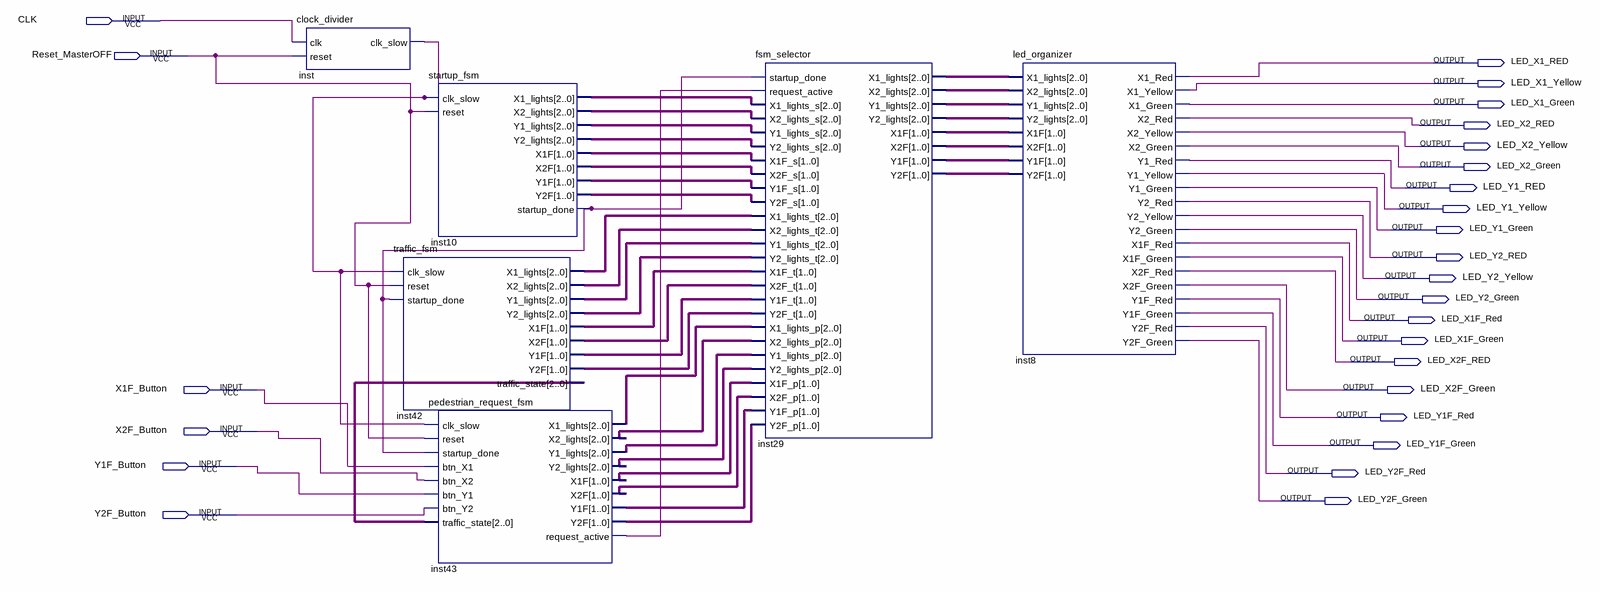
[diagram p0: schematic sheet]
// Quartus schematic Trafic_light.bdf as structural Verilog: 6 symbols, 26 pins
module Trafic_light (
  input  CLK,
  input  Reset_MasterOFF,
  input  X1F_Button,
  input  X2F_Button,
  input  Y1F_Button,
  input  Y2F_Button,
  output LED_X1_RED,
  output LED_X1_Yellow,
  output LED_X1_Green,
  output LED_X2_RED,
  output LED_X2_Yellow,
  output LED_X2_Green,
  output LED_Y1_RED,
  output LED_Y1_Yellow,
  output LED_Y1_Green,
  output LED_Y2_RED,
  output LED_Y2_Yellow,
  output LED_Y2_Green,
  output LED_X1F_Red,
  output LED_X1F_Green,
  output LED_X2F_RED,
  output LED_X2F_Green,
  output LED_Y1F_Red,
  output LED_Y1F_Green,
  output LED_Y2F_Red,
  output LED_Y2F_Green
);

  wire inst10_startup_done, inst43_request_active, inst_clk_slow;
  wire [1:0] inst10_x1f, inst10_x2f, inst10_y1f, inst10_y2f, inst29_x1f, inst29_x2f, inst29_y1f, inst29_y2f,
       inst42_x1f, inst42_x2f, inst42_y1f, inst42_y2f, inst43_x1f, inst43_x2f, inst43_y1f, inst43_y2f;
  wire [2:0] inst10_x1_lights, inst10_x2_lights, inst10_y1_lights, inst10_y2_lights, inst29_x1_lights,
       inst29_x2_lights, inst29_y1_lights, inst29_y2_lights, inst42_traffic_state, inst42_x1_lights,
       inst42_x2_lights, inst42_y1_lights, inst42_y2_lights, inst43_x1_lights, inst43_x2_lights,
       inst43_y1_lights, inst43_y2_lights;

  clock_divider inst (.clk(CLK), .reset(Reset_MasterOFF), .clk_slow(inst_clk_slow));
  traffic_fsm inst42 (
    .clk_slow(inst_clk_slow), .reset(Reset_MasterOFF), .startup_done(inst10_startup_done),
    .X1_lights(inst42_x1_lights), .X2_lights(inst42_x2_lights), .Y1_lights(inst42_y1_lights),
    .Y2_lights(inst42_y2_lights), .X1F(inst42_x1f), .X2F(inst42_x2f), .Y1F(inst42_y1f), .Y2F(inst42_y2f),
    .traffic_state(inst42_traffic_state));
  startup_fsm inst10 (
    .clk_slow(inst_clk_slow), .reset(Reset_MasterOFF), .X1_lights(inst10_x1_lights),
    .X2_lights(inst10_x2_lights), .Y1_lights(inst10_y1_lights), .Y2_lights(inst10_y2_lights),
    .X1F(inst10_x1f), .X2F(inst10_x2f), .Y1F(inst10_y1f), .Y2F(inst10_y2f), .startup_done(inst10_startup_done));
  pedestrian_request_fsm inst43 (
    .clk_slow(inst_clk_slow), .reset(Reset_MasterOFF), .startup_done(inst10_startup_done),
    .btn_X1(X1F_Button), .btn_X2(X2F_Button), .btn_Y1(Y1F_Button), .btn_Y2(Y2F_Button),
    .traffic_state(inst42_traffic_state), .X1_lights(inst43_x1_lights), .X2_lights(inst43_x2_lights),
    .Y1_lights(inst43_y1_lights), .Y2_lights(inst43_y2_lights), .X1F(inst43_x1f), .X2F(inst43_x2f),
    .Y1F(inst43_y1f), .Y2F(inst43_y2f), .request_active(inst43_request_active));
  fsm_selector inst29 (
    .startup_done(inst10_startup_done), .request_active(inst43_request_active),
    .X1_lights_s(inst10_x1_lights), .X2_lights_s(inst10_x2_lights), .Y1_lights_s(inst10_y1_lights),
    .Y2_lights_s(inst10_y2_lights), .X1F_s(inst10_x1f), .X2F_s(inst10_x2f), .Y1F_s(inst10_y1f),
    .Y2F_s(inst10_y2f), .X1_lights_t(inst42_x1_lights), .X2_lights_t(inst42_x2_lights),
    .Y1_lights_t(inst42_y1_lights), .Y2_lights_t(inst42_y2_lights), .X1F_t(inst42_x1f), .X2F_t(inst42_x2f),
    .Y1F_t(inst42_y1f), .Y2F_t(inst42_y2f), .X1_lights_p(inst43_x1_lights), .X2_lights_p(inst43_x2_lights),
    .Y1_lights_p(inst43_y1_lights), .Y2_lights_p(inst43_y2_lights), .X1F_p(inst43_x1f), .X2F_p(inst43_x2f),
    .Y1F_p(inst43_y1f), .Y2F_p(inst43_y2f), .X1_lights(inst29_x1_lights), .X2_lights(inst29_x2_lights),
    .Y1_lights(inst29_y1_lights), .Y2_lights(inst29_y2_lights), .X1F(inst29_x1f), .X2F(inst29_x2f),
    .Y1F(inst29_y1f), .Y2F(inst29_y2f));
  led_organizer inst8 (
    .X1_lights(inst29_x1_lights), .X2_lights(inst29_x2_lights), .Y1_lights(inst29_y1_lights),
    .Y2_lights(inst29_y2_lights), .X1F(inst29_x1f), .X2F(inst29_x2f), .Y1F(inst29_y1f), .Y2F(inst29_y2f),
    .X1_Red(LED_X1_RED), .X1_Yellow(LED_X1_Yellow), .X1_Green(LED_X1_Green), .X2_Red(LED_X2_RED),
    .X2_Yellow(LED_X2_Yellow), .X2_Green(LED_X2_Green), .Y1_Red(LED_Y1_RED), .Y1_Yellow(LED_Y1_Yellow),
    .Y1_Green(LED_Y1_Green), .Y2_Red(LED_Y2_RED), .Y2_Yellow(LED_Y2_Yellow), .Y2_Green(LED_Y2_Green),
    .X1F_Red(LED_X1F_Red), .X1F_Green(LED_X1F_Green), .X2F_Red(LED_X2F_RED), .X2F_Green(LED_X2F_Green),
    .Y1F_Red(LED_Y1F_Red), .Y1F_Green(LED_Y1F_Green), .Y2F_Red(LED_Y2F_Red), .Y2F_Green(LED_Y2F_Green));
endmodule
